# Altium schematic sheet SDRAM.SchDoc
size A4
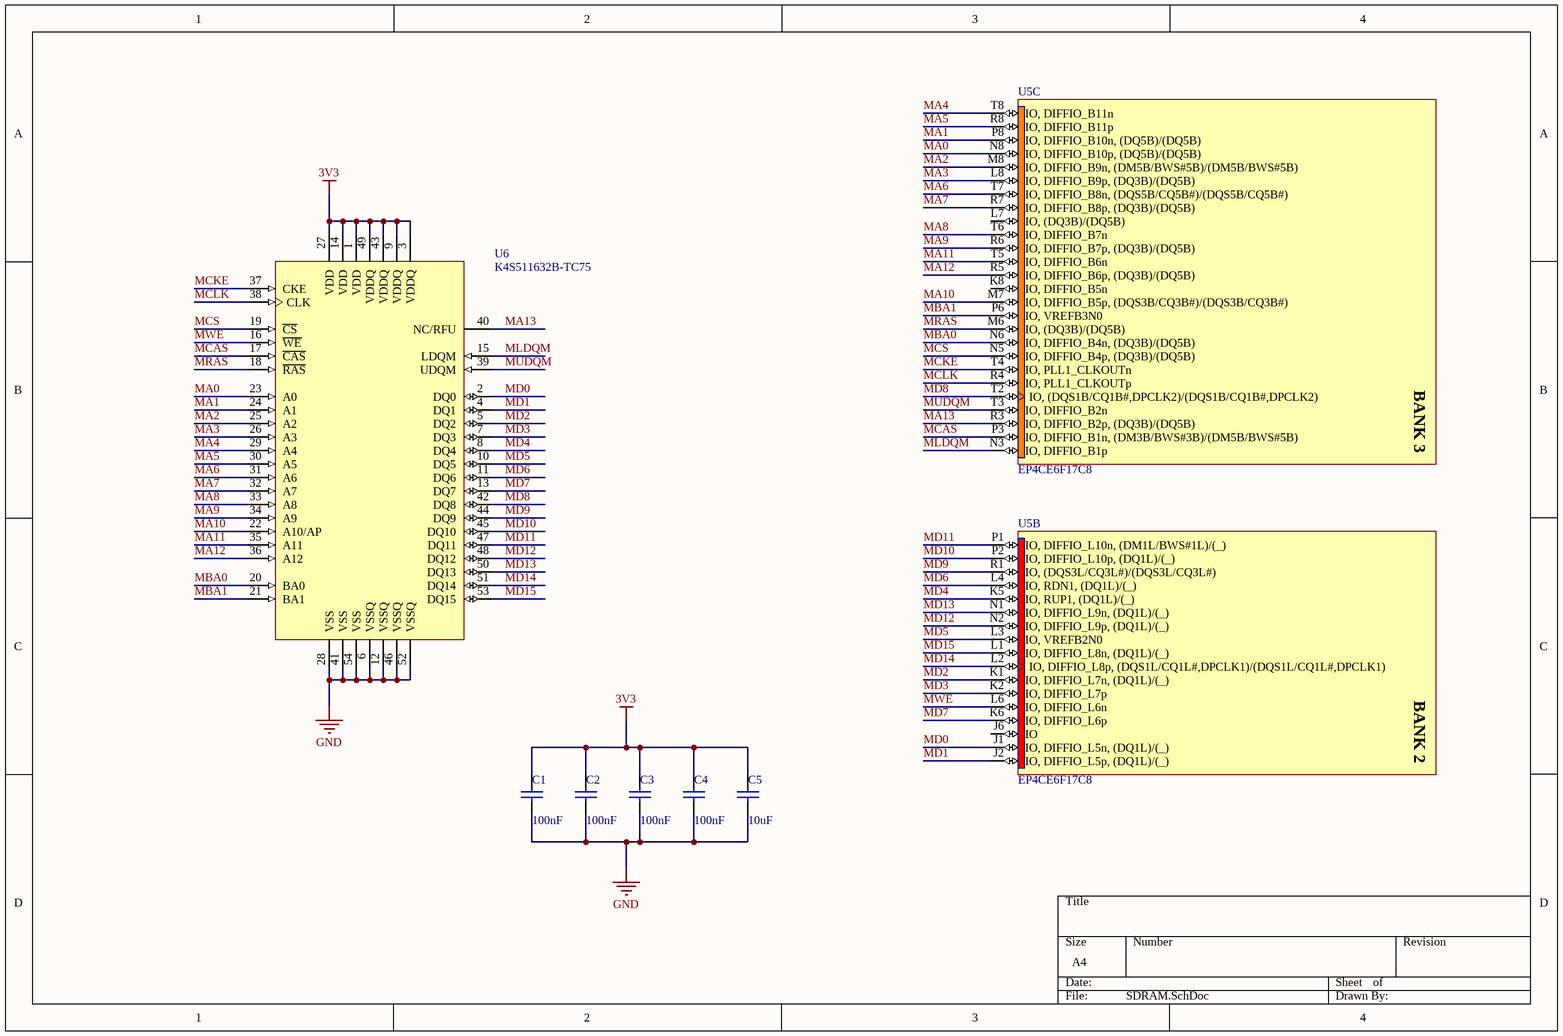
[diagram p0: SDRAM.SchDoc]

## Parts
C1  100nF  [C0603]
C2  100nF  [C0603]
C3  100nF  [C0603]
C4  100nF  [C0603]
C5  10uF  [C1206]
U5  EP4CE6F17C8  [FBGA256]  (parts B,C of 13)
U6  K4S511632B-TC75  [54_TSOP2_400AF_N]

## Nets
3V3: C1.2 C2.2 C3.2 C4.2 C5.1 U6.1(VDD) U6.3(VDDQ) U6.9(VDDQ) U6.14(VDD) U6.27(VDD) U6.43(VDDQ) U6.49(VDDQ)
GND: C1.1 C2.1 C3.1 C4.1 C5.2 U6.6(VSSQ) U6.12(VSSQ) U6.28(VSS) U6.41(VSS) U6.46(VSSQ) U6.52(VSSQ) U6.54(VSS)
MA0: U5.N8(IO,_DIFFIO_B10p,_(DQ5B)/(DQ5B)) U6.23(A0)
MA1: U5.P8(IO,_DIFFIO_B10n,_(DQ5B)/(DQ5B)) U6.24(A1)
MA2: U5.M8(IO,_DIFFIO_B9n,_(DM5B/BWS#5B)/(DM5B/BWS#5B)) U6.25(A2)
MA3: U5.L8(IO,_DIFFIO_B9p,_(DQ3B)/(DQ5B)) U6.26(A3)
MA4: U5.T8(IO,_DIFFIO_B11n) U6.29(A4)
MA5: U5.R8(IO,_DIFFIO_B11p) U6.30(A5)
MA6: U5.T7(IO,_DIFFIO_B8n,_(DQS5B/CQ5B#)/(DQS5B/CQ5B#)) U6.31(A6)
MA7: U5.R7(IO,_DIFFIO_B8p,_(DQ3B)/(DQ5B)) U6.32(A7)
MA8: U5.T6(IO,_DIFFIO_B7n) U6.33(A8)
MA9: U5.R6(IO,_DIFFIO_B7p,_(DQ3B)/(DQ5B)) U6.34(A9)
MA10: U5.M7(IO,_DIFFIO_B5p,_(DQS3B/CQ3B#)/(DQS3B/CQ3B#)) U6.22(A10/AP)
MA11: U5.T5(IO,_DIFFIO_B6n) U6.35(A11)
MA12: U5.R5(IO,_DIFFIO_B6p,_(DQ3B)/(DQ5B)) U6.36(A12)
MA13: U5.R3(IO,_DIFFIO_B2p,_(DQ3B)/(DQ5B)) U6.40(NC/RFU)
MBA0: U5.N6(IO,_DIFFIO_B4n,_(DQ3B)/(DQ5B)) U6.20(BA0)
MBA1: U5.P6(IO,_VREFB3N0) U6.21(BA1)
MCAS: U5.P3(IO,_DIFFIO_B1n,_(DM3B/BWS#3B)/(DM5B/BWS#5B)) U6.17(~{CAS})
MCKE: U5.T4(IO,_PLL1_CLKOUTn) U6.37(CKE)
MCLK: U5.R4(IO,_PLL1_CLKOUTp) U6.38(CLK)
MCS: U5.N5(IO,_DIFFIO_B4p,_(DQ3B)/(DQ5B)) U6.19(~{CS})
MD0: U5.J1(IO,_DIFFIO_L5n,_(DQ1L)/(_)) U6.2(DQ0)
MD1: U5.J2(IO,_DIFFIO_L5p,_(DQ1L)/(_)) U6.4(DQ1)
MD2: U5.K1(IO,_DIFFIO_L7n,_(DQ1L)/(_)) U6.5(DQ2)
MD3: U5.K2(IO,_DIFFIO_L7p) U6.7(DQ3)
MD4: U5.K5(IO,_RUP1,_(DQ1L)/(_)) U6.8(DQ4)
MD5: U5.L3(IO,_VREFB2N0) U6.10(DQ5)
MD6: U5.L4(IO,_RDN1,_(DQ1L)/(_)) U6.11(DQ6)
MD7: U5.K6(IO,_DIFFIO_L6p) U6.13(DQ7)
MD8: U5.T2(IO,_(DQS1B/CQ1B#,DPCLK2)/(DQS1B/CQ1B#,DPCLK2)) U6.42(DQ8)
MD9: U5.R1(IO,_(DQS3L/CQ3L#)/(DQS3L/CQ3L#)) U6.44(DQ9)
MD10: U5.P2(IO,_DIFFIO_L10p,_(DQ1L)/(_)) U6.45(DQ10)
MD11: U5.P1(IO,_DIFFIO_L10n,_(DM1L/BWS#1L)/(_)) U6.47(DQ11)
MD12: U5.N2(IO,_DIFFIO_L9p,_(DQ1L)/(_)) U6.48(DQ12)
MD13: U5.N1(IO,_DIFFIO_L9n,_(DQ1L)/(_)) U6.50(DQ13)
MD14: U5.L2(IO,_DIFFIO_L8p,_(DQS1L/CQ1L#,DPCLK1)/(DQS1L/CQ1L#,DPCLK1)) U6.51(DQ14)
MD15: U5.L1(IO,_DIFFIO_L8n,_(DQ1L)/(_)) U6.53(DQ15)
MLDQM: U5.N3(IO,_DIFFIO_B1p) U6.15(LDQM)
MRAS: U5.M6(IO,_(DQ3B)/(DQ5B)) U6.18(~{RAS})
MUDQM: U5.T3(IO,_DIFFIO_B2n) U6.39(UDQM)
MWE: U5.L6(IO,_DIFFIO_L6n) U6.16(~{WE})

Not connected (* = marked no-connect by the designer): U5 J6(IO) K8(IO,_DIFFIO_B5n) L7(IO,_(DQ3B)/(DQ5B))

## Notes on the sheet
- (in symbol EP4CE6F17C8, part B) BANK 2
- (in symbol EP4CE6F17C8, part C) BANK 3

## Library data of the parts
C1-C5 = Cap: Capacitor; Published: 8-Jun-2000; LatestRevisionDate: 17-Jul-2002; LatestRevisionNote: Re-released for DXP Platform.; PackageReference: RAD-0.3; Publisher: Altium Limited
U5 = EP4CE6F17C8: Cyclone IV Family FPGA, 2V Core, 179 I/O Pins, 2 PLLs, 256-Pin FBGA, Speed Grade 8, Commercial Grade; Published: 3-May-2010; DatasheetVersion: ver1.2, Mar-2010; PackageVersion: ver16.0, Dec-2009; PackageReference: FBGA256; Publisher: Altium Limited; PackageDescription: 256-Ball FineLine Ball Grid Array (FBGA256) - Option 1 - Wire Bond; Code_JEDEC: MS-034-AAF-1; Code_IPC: BGA100P16X16-256; ComponentLink1Description: Manufacturer Link; ComponentLink1URL: http://www.altera.com/; ComponentLink2Description: Handbook; ComponentLink2URL: http://www.altera.com/literature/hb/cyclone-iv/cyclone4-handbook.pdf; ComponentLink3Description: Pinout Specification; ComponentLink3URL: http://www.altera.com/literature/lit-dp.jsp?category=cyc%204&showspreadsheet=y; ComponentLink4Description: Packaging Specification; ComponentLink4URL: http://www.altera.com/literature/ds/dspkg.pdf
U6 = K4S511632B-TC75: 512Mb Synchronous High Data Rate DRAM, 8Mb x 16Bit x 4 Banks, 54-Pin TSOP; Frequency: 133MHz (max); RowAddress: A0-A12; ColumnAddress: A0-A9; Published: 11-Oct-2004; LatestRevisionDate: 13-Apr-2006; LatestRevisionNote: IPC-7351 Footprint Added.; DatasheetVersion: rev1.1, Feb-2004; PackageVersion: Aug-2004; PackageReference: 54_TSOP2_400AF; Publisher: Altium Limited; PackageDescription: 54-Pin Small Outline Package 0.8 mm Pitch; ComponentLink1Description: Manufacturer Link; ComponentLink1URL: http://www.samsung.com; ComponentLink2Description: Datasheet; ComponentLink2URL: http://www.samsung.com/Products/Semiconductor/DRAM/SDRAM/SDRAMcomponent/512Mbit/K4S510432B/ds_sdr_512mb_b-die_x4x8x16_11.pdf